# Altium schematic sheet Power.SchDoc
size A4; SheetNumber: 13; SheetTotal: 14
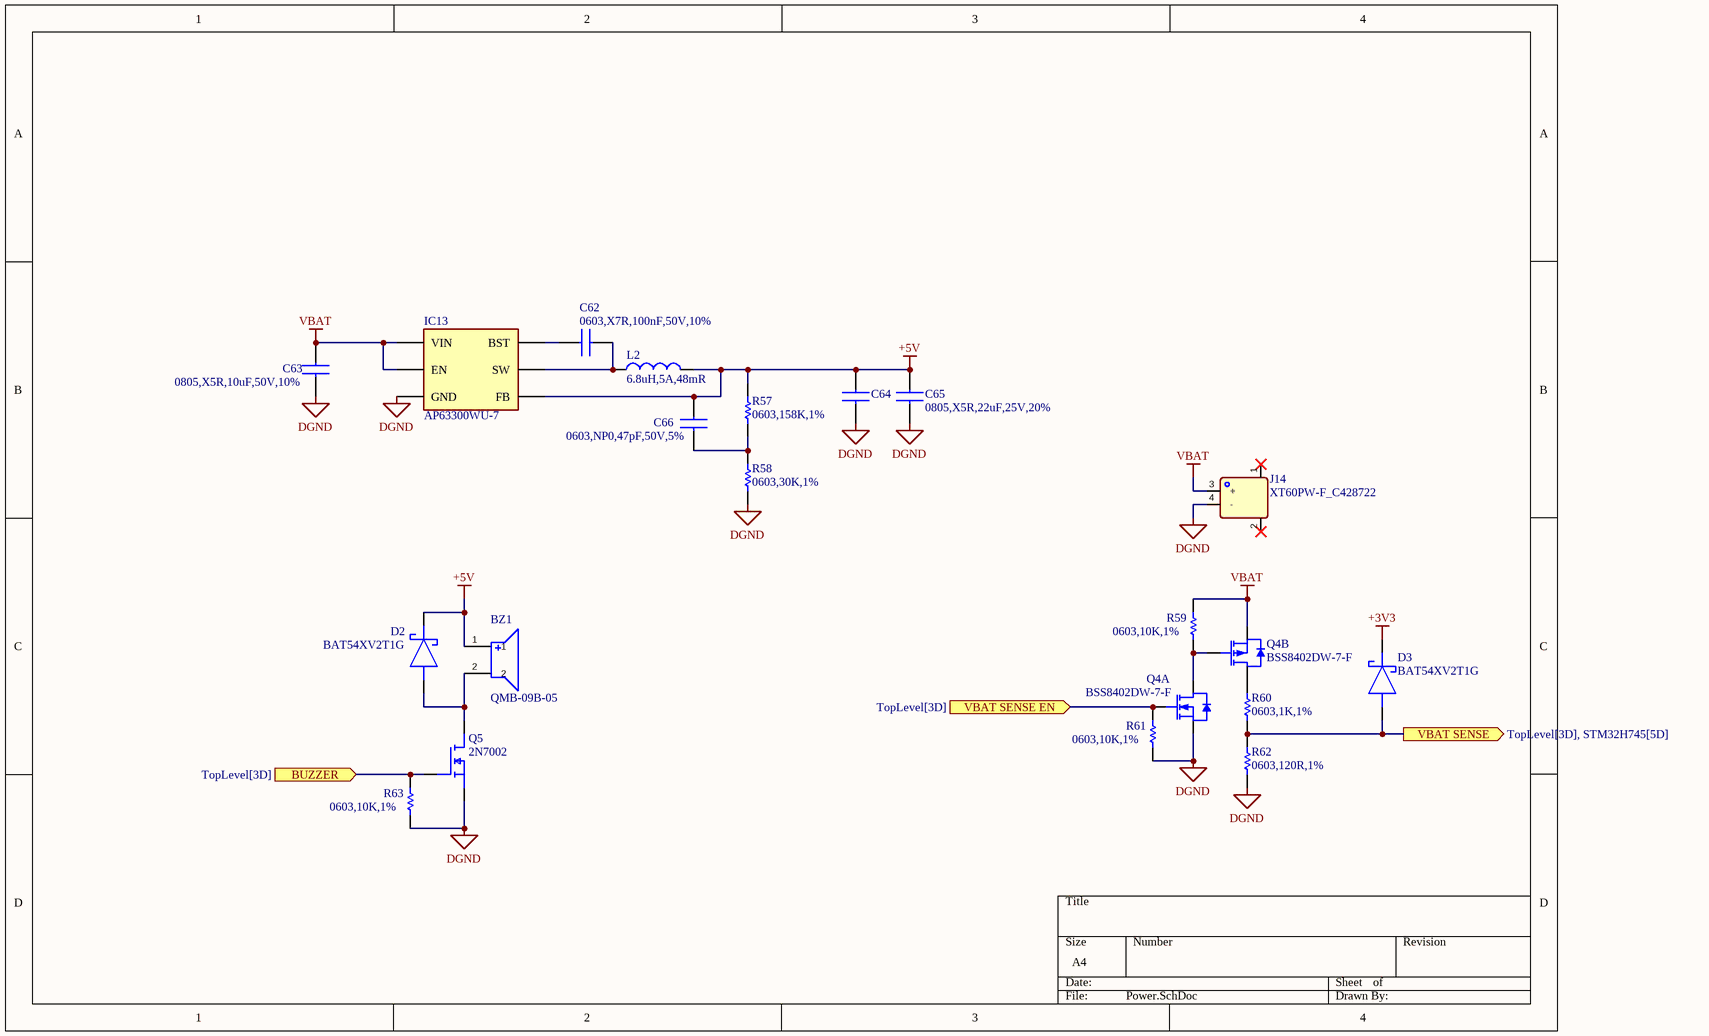
[diagram p0: Power.SchDoc]

## Parts
BZ1  QMB-09B-05  [QMB-09B-05]
C62  0603,X7R,100nF,50V,10%  [CAPC1608X90N]
C63  0805,X5R,10uF,50V,10%  [CAPC2012X145N]
C64  0805,X5R,22uF,25V,20%  [CAPC2012X145N]  (value not drawn)
C65  0805,X5R,22uF,25V,20%  [CAPC2012X145N]
C66  0603,NP0,47pF,50V,5%  [CAPC1608X90N]
D2  BAT54XV2T1G  [SOD523]
D3  BAT54XV2T1G  [SOD523]
IC13  AP63300WU-7  [SOT95P280X90-6N]
J14  XT60PW-F_C428722  [XT60PW-F_C428722]
L2  6.8uH,5A,48mR  [FXL0630-6R8-M]
Q4  BSS8402DW-7-F  [SOT65P210X110-6N]  (parts A,B of 2)
Q5  2N7002  [SOT95P230X110-3N]
R57  0603,158K,1%  [RESC1608X90N]
R58  0603,30K,1%  [RESC1608X90N]
R59  0603,10K,1%  [RESC1608X90N]
R60  0603,1K,1%  [RESC1608X90N]
R61  0603,10K,1%  [RESC1608X90N]
R62  0603,120R,1%  [RESC1608X90N]
R63  0603,10K,1%  [RESC1608X90N]

## Ports
BUZZER (in, see TopLevel[3D]), VBAT SENSE (out, see TopLevel[3D], STM32H745[5D]), VBAT SENSE EN (in, see TopLevel[3D])

## Nets
+3V3: D3.1(K)
+5V: BZ1.1 C64.2 C65.2 C66.2 D2.1(K) IC13.1(FB) L2.2 R57.2
DGND: C63.1 C64.1 C65.1 IC13.4(GND) J14.4(-) Q4.1(S1) Q5.2(S) R58.1 R61.1 R62.1 R63.1
VBAT: C63.2 IC13.2(EN) IC13.3(VIN) J14.3(+) Q4.4(S2) R59.2
BUZZER: Q5.1(G) R63.2 ; port BUZZER
VBAT SENSE: D3.2(A) R60.1 R62.2 ; port VBAT SENSE
VBAT SENSE EN: Q4.2(G1) R61.2 ; port VBAT SENSE EN
NetBZ1_2: BZ1.2 D2.2(A) Q5.3(D)
NetC62_1: C62.1 IC13.6(BST)
NetC62_2: C62.2 IC13.5(SW) L2.1
NetC66_1: C66.1 R57.1 R58.2
NetQ4_3: Q4.3(D2) R60.2
NetQ4_5: Q4.5(G2) Q4.6(D1) R59.1

Not connected (* = marked no-connect by the designer): J14 1* 2*

## Library data of the parts
BZ1 = QMB-09B-05: -40℃~+85℃ 2.7kHz 3V~7V 5.7mm 5V 60mA 80dB 9mm Electromagnetic Passive (Externally Driven) 插件,D=9mm Buzzers ROHS; LCSC Part #: C161819; Manu Part #: QMB-09B-05
C62 = CC0603KRX7R9BB104: 50V 100nF X7R ±10% 0603 Multilayer Ceramic Capacitors MLCC - SMD/SMT ROHS; LCSC Part #: C14663; Manu Part #: CC0603KRX7R9BB104
C63 = GRM21BR61H106KE43L: 10uF 50V X5R ±10% 0805 Multilayer Ceramic Capacitors MLCC - SMD/SMT ROHS; LCSC Part #: C440198; Manu Part #: GRM21BR61H106KE43L
C64 C65 = CL21A226MAQNNNE: 22uF ±20% 25V Ceramic Capacitor X5R 0805; LCSC Part #: C45783; Manu Part #: CL21A226MAQNNNE
C66 = CL10C470JB8NNNC: 47 pF ±5% 50V Ceramic Capacitor C0G, NP0 0603 (1608 Metric); Manu Part #: CL10C470JB8NNNC; LCSC Part #: C1671
D2 D3 = BAT54XV2T1G: Diode 30V 200mA Surface Mount SOD-523; Manu Part #: BAT54XV2T1G; LCSC Part #: C81572
IC13 = AP63300WU-7: 3.8V to 32V Input, 3A Low IQ Synchronous Buck Converter with Enhanced EMI Reduction; Manu Part #: AP63300WU-7; LCSC Part #: C2158012
J14 = XT60PW-F_C428722: Horizontal plug Yellow - Power connector / plug connector; LCSC Part #: C428722; Manu Part #: XT60PW-F
L2 = FXL0630-6R8-M: 48mΩ 5A 6.8uH 6A Molded Inductor ±20% SMD,7x6.6mm Power Inductors ROHS; Manu Part #: FXL0630-6R8-M; LCSC Part #: C167221
Q4 = BSS8402DW-7-F: N-Channel+P-Channel Array 60V 130mA 200mW Surface Mount SOT-363; Manu Part #: BSS8402DW-7-F; LCSC Part #: C156386
Q5 = 2N7002: N-Channel 60V 300mA 830mW Surface Mount SOT-23; Manu Part #: 2N7002; LCSC Part #: C8545
R57 = 0603WAF1583T5E: -55℃~+155℃ 100mW 158kΩ 75V Thick Film Resistor ±1% ±100ppm/℃ 0603 Chip Resistor - Surface Mount ROHS; Manu Part #: 0603WAF1583T5E; LCSC Part #: C22883
R58 = 0603WAF3002T5E: -55℃~+155℃ 100mW 30kΩ 75V Thick Film Resistor ±1% ±100ppm/℃ 0603 Chip Resistor - Surface Mount ROHS; LCSC Part #: C22984; Manu Part #: 0603WAF3002T5E
R59 R61 R63 = 0603WAF1002T5E: 100mW Thick Film Resistor 75V ±100ppm/℃ ±1% 10kΩ 0603 Chip Resistor - Surface Mount ROHS; LCSC Part #: C25804; Manu Part #: 0603WAF1002T5E
R60 = 0603WAF1001T5E: 100mW 1kΩ 75V Thick Film Resistor ±100ppm/℃ ±1% 0603 Chip Resistor - Surface Mount RoHS; LCSC Part #: C21190; Manu Part #: 0603WAF1001T5E
R62 = 0603WAF1200T5E: -55℃~+155℃ 100mW 120Ω 75V Thick Film Resistor ±1% ±100ppm/℃ 0603 Chip Resistor - Surface Mount ROHS; Manu Part #: 0603WAF1200T5E; LCSC Part #: C22787